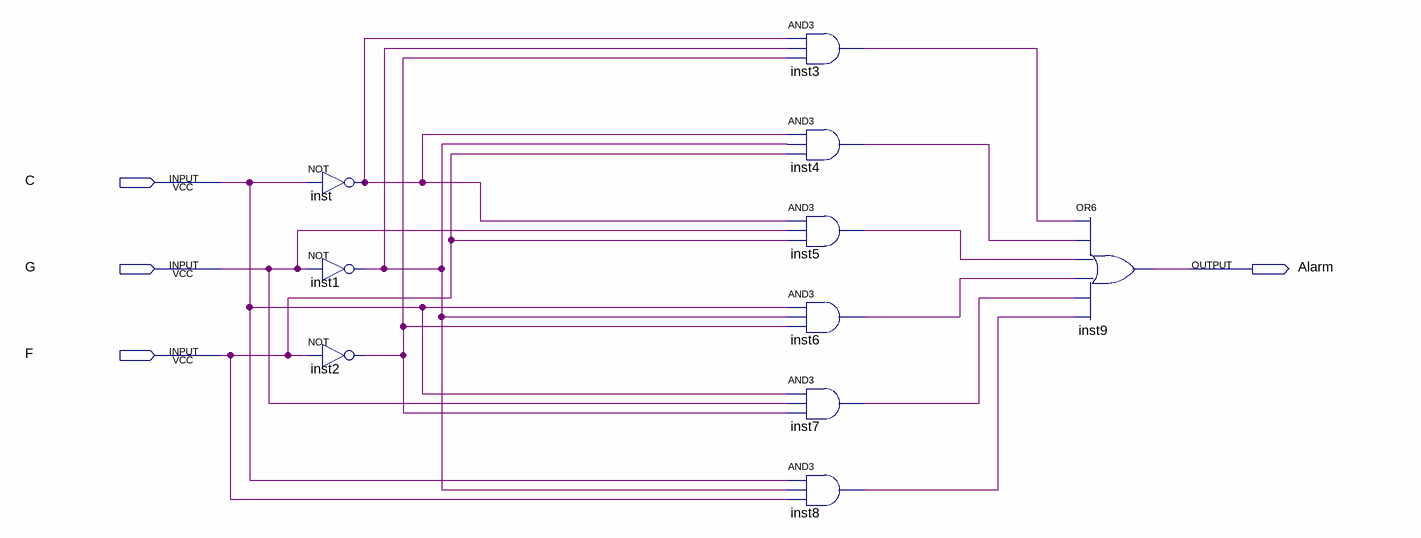
[diagram p0: schematic sheet]
// Quartus schematic lab2step2.bdf as structural Verilog: 10 symbols, 4 pins
module lab2step2 (
  input  C,
  input  G,
  input  F,
  output Alarm
);

  wire inst1_out, inst2_out, inst3_out, inst4_out, inst5_out, inst6_out, inst7_out, inst8_out, inst_out;

  not inst (inst_out, C);
  not inst1 (inst1_out, G);
  not inst2 (inst2_out, F);
  and inst3 (inst3_out, inst_out, inst1_out, inst2_out);
  and inst4 (inst4_out, inst_out, inst1_out, F);
  and inst5 (inst5_out, inst_out, G, F);
  and inst6 (inst6_out, C, inst1_out, inst2_out);
  and inst7 (inst7_out, C, G, inst2_out);
  and inst8 (inst8_out, C, inst1_out, F);
  or inst9 (Alarm, inst3_out, inst4_out, inst5_out, inst6_out, inst7_out, inst8_out);
endmodule
